# EAGLE schematic proton (EAGLE 8.4.1)
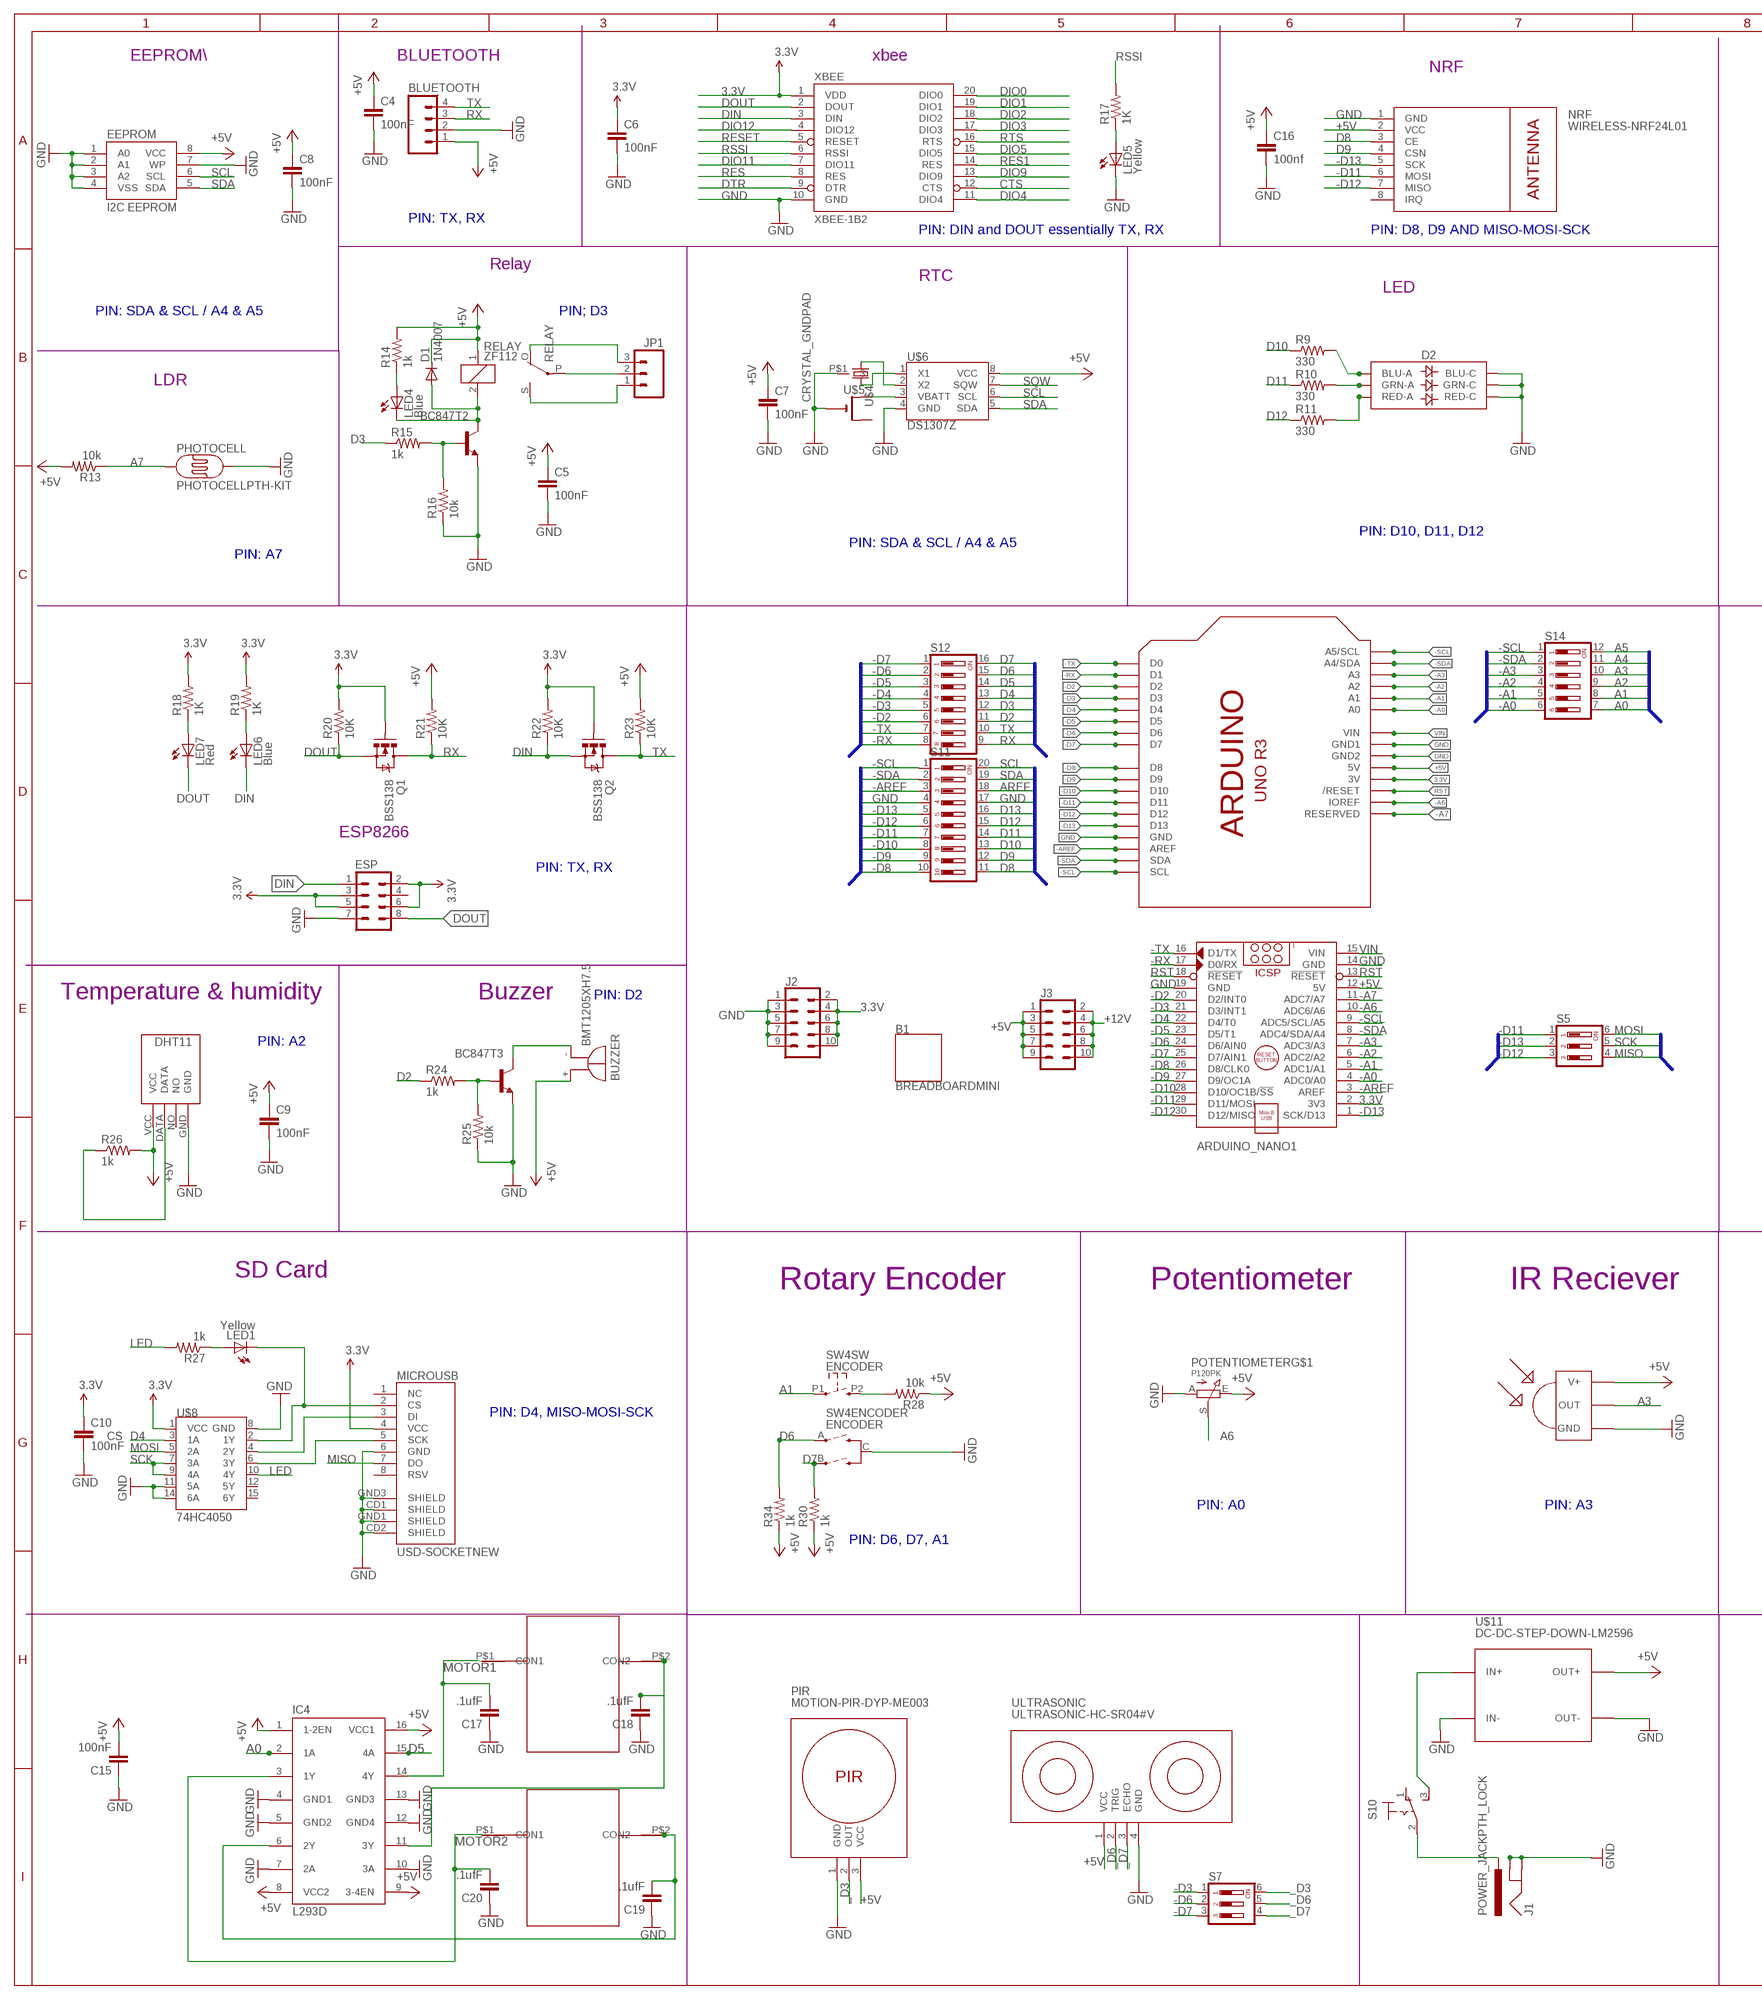
[diagram p0: schematic, sheet 1, part 1 of 2]
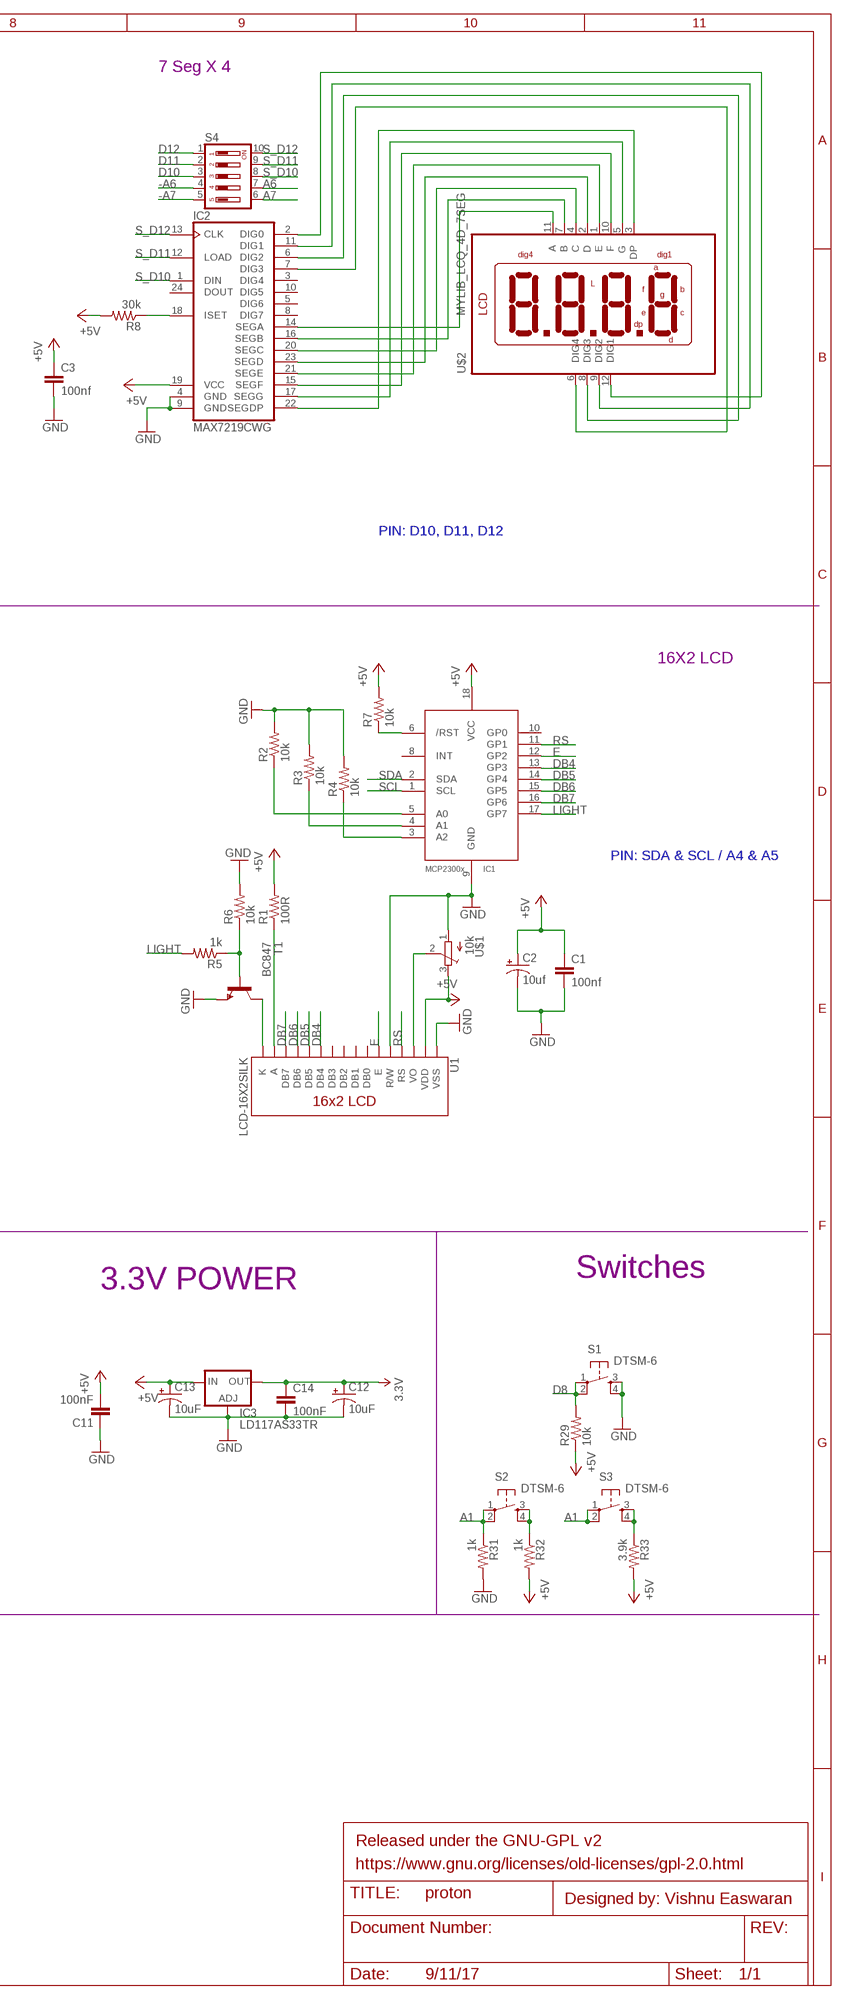
[diagram p1: schematic, sheet 1, part 2 of 2]

## Parts
ARDUINO_NANO1  ARDUINO_NANO  [ARDUINO_NANO]
B1  BREADBOARDMINI  [BREADBOARD-MINI]
BLUETOOTH  M04PTH  [1X04]
BUZZER  BMT1205XH7.5  [BMT1205XH7.5]
C1  100nf  CAP0805  [0805]
C2  10uf  CAP_POL1206  [EIA3216]
C3  100nf  CAP0805  [0805]
C4  100nF  CAP0805  [0805]
C5  100nF  CAP0805  [0805]
C6  100nF  CAP0805  [0805]
C7  100nF  CAP0805  [0805]
C8  100nF  CAP0805  [0805]
C9  100nF  CAP0805  [0805]
C10  100nF  CAP0805  [0805]
C11  100nF  CAP0805  [0805]
C12  10uF  CAP_POL1206  [EIA3216]
C13  10uF  CAP_POL1206  [EIA3216]
C14  100nF  CAP0805  [0805]
C15  100nF  CAP0805  [0805]
C16  100nf  CAP0805  [0805]
C17  .1ufF  CAP0805  [0805]
C18  .1ufF  CAP0805  [0805]
C19  .1ufF  CAP0805  [0805]
C20  .1ufF  CAP0805  [0805]
D1  1N4007  DIODESMA-ALT  [SMA-DIODE_ALT]
D2  LED-RGBNO_IC  [LED-TRICOLOR-5050]
EEPROM  I2C EEPROM  EEPROM-I2CEIAJ  [SO08-EIAJ]
ESP  M04X2  [2X4]
IC1  MCP2300X/SO  [SO18W]
IC2  MAX7219CWG  [SO24W]
IC3  LD117AS33TR  [SOT223]
IC4  L293D  [DIL16]
IR  TSOP1730  [TSOP17XX]
J1  POWER_JACKPTH_LOCK  [POWER_JACK_PTH_LOCK]
J2  CONN_05X2NO_SILK  [2X5_NOSILK]
J3  CONN_05X2NO_SILK  [2X5_NOSILK]
JP1  M03-SCREW-5MM  [SCREWTERMINAL-5MM-3]
LED1  Yellow  LEDCHIPLED_0805  [CHIPLED_0805]
LED4  Blue  LEDCHIPLED_0805  [CHIPLED_0805]
LED5  Yellow  LEDCHIPLED_0805  [CHIPLED_0805]
LED6  Blue  LEDCHIPLED_0805  [CHIPLED_0805]
LED7  Red  LEDCHIPLED_0805  [CHIPLED_0805]
MICROUSB  USD-SOCKETNEW  [MICRO-SD-SOCKET-PP]
MOTOR1  TOY_MOTOR  [TOY_MOTOR]
MOTOR2  TOY_MOTOR  [TOY_MOTOR]
NRF  WIRELESS-NRF24L01  [WIRELESS-NRF24L01]
PHOTOCELL  PHOTOCELLPTH-KIT  [PHOTOCELL-KIT]
PIR  MOTION-PIR-DYP-ME003  [MOTION-PIR-DYP-ME003]
POTENTIOMETER  P120PK  [P120PK]
Q1  BSS138  MOSFET-NCHANNELSMD  [SOT23-3]
Q2  BSS138  MOSFET-NCHANNELSMD  [SOT23-3]
R1  100R  RESISTOR0805-RES  [0805]
R2  10k  RESISTOR0805-RES  [0805]
R3  10k  RESISTOR0805-RES  [0805]
R4  10k  RESISTOR0805-RES  [0805]
R5  1k  RESISTOR0805-RES  [0805]
R6  10k  RESISTOR0805-RES  [0805]
R7  10k  RESISTOR0805-RES  [0805]
R8  30k  RESISTOR0805-RES  [0805]
R9  330  RESISTOR0805-RES  [0805]
R10  330  RESISTOR0805-RES  [0805]
R11  330  RESISTOR0805-RES  [0805]
R13  10k  RESISTOR0805-RES  [0805]
R14  1k  RESISTOR0805-RES  [0805]
R15  1k  RESISTOR0805-RES  [0805]
R16  10k  RESISTOR0805-RES  [0805]
R17  1K  RESISTOR0805-RES  [0805]
R18  1K  RESISTOR0805-RES  [0805]
R19  1K  RESISTOR0805-RES  [0805]
R20  10K  RESISTOR0805-RES  [0805]
R21  10K  RESISTOR0805-RES  [0805]
R22  10K  RESISTOR0805-RES  [0805]
R23  10K  RESISTOR0805-RES  [0805]
R24  1k  RESISTOR0805-RES  [0805]
R25  10k  RESISTOR0805-RES  [0805]
R26  1k  RESISTOR0805-RES  [0805]
R27  1k  RESISTOR0805-RES  [0805]
R28  10k  RESISTOR0805-RES  [0805]
R29  10k  RESISTOR0805-RES  [0805]
R30  1k  RESISTOR0805-RES  [0805]
R31  1k  RESISTOR0805-RES  [0805]
R32  1k  RESISTOR0805-RES  [0805]
R33  3.9k  RESISTOR0805-RES  [0805]
R34  1k  RESISTOR0805-RES  [0805]
RELAY  ZF112  [ZF112]
S1  DTSM-6  [DTSM-6]
S2  DTSM-6  [DTSM-6]
S3  DTSM-6  [DTSM-6]
S4  DIP05YL  [DIP05YL]
S5  DIP03YL  [DIP03YL]
S7  DIP03YL  [DIP03YL]
S10  M9040P  [M9040P]
S11  DIP10YL  [DIP10YL]
S12  DIP08YL  [DIP08YL]
S14  DIP06YL  [DIP06YL]
SW4  ENCODER  ENCODER_SW1-PEC12  [PEC12_INCREMENTAL_ENCODER]
T1  BC847  MMBT2222ALT1-NPN-SOT23-BEC  [SOT23-BEC]
T2  BC847  MMBT2222ALT1-NPN-SOT23-BEC  [SOT23-BEC]
T3  BC847  MMBT2222ALT1-NPN-SOT23-BEC  [SOT23-BEC]
TEMPERATURESENSOR  DHT11  [DHT11]
U1  LCD-16X2SILK  [LCD-16X2]
U$1  10k  TRIMPOTTC33X  [TC33X]
U$2  MYLIB_LCQ_4D_7SEG  [MYLIB_LDQ_4D_7SEG]
U$4  CRYSTAL_GNDPAD  [TC38H_GNDPAD]
U$5  CR1220SMT  [CR1220-SMD]
U$6  DS1307Z  [SO08-0.15]
U$8  74HC4050  HEX_CONVERTER  [SO016]
U$11  DC-DC-STEP-DOWN-LM2596  [DC-DC-STEP-DOWN-LM2596]
U$14  UNO_R3  [UNO_R3]
ULTRASONIC  ULTRASONIC-HC-SR04#V  [ULTRASONIC-HC-SR04#V]
XBEE  XBEE-1B2  [XBEE-SILK]

## Nets
3.3V: ARDUINO_NANO1.2(3V3) C6.1 C10.1 C12.A(+) C14.1 ESP.2 ESP.3 ESP.5 ESP.6 IC3.4(OUT) J2.2 J2.4 J2.6 J2.8 J2.10 MICROUSB.4(VCC) Q1.1(G) Q2.1(G) R18.2 R19.2 R20.2 R22.2 U$8.1(VCC) U$14.3V XBEE.1(VDD)
+5V: ARDUINO_NANO1.12(5V) BLUETOOTH.1 BUZZER.+ C1.1 C2.A(+) C3.1 C4.1 C5.1 C7.1 C8.1 C9.1 C11.2 C13.A(+) C15.2 C16.1 D1.C EEPROM.8(VCC) IC1.18(VCC) IC2.19(VCC) IC3.3(IN) IC4.1(1-2EN) IC4.8(VCC2) IC4.9(3-4EN) IC4.16(VCC1) IR.V+ J3.1 J3.3 J3.5 J3.7 J3.9 NRF.2(VCC) PIR.3(VCC) POTENTIOMETER.E R1.2 R7.2 R8.2 R13.2 R14.2 R21.2 R23.2 R26.2 R28.1 R29.1 R30.1 R32.2 R33.2 R34.1 RELAY.1 TEMPERATURESENSOR.VCC U1.2(VDD) U$1.3(E) U$6.8(VCC) U$11.OUT+ U$14.5V ULTRASONIC.1(VCC)
+12V: J1.PWR J3.2 J3.4 J3.6 J3.8 J3.10 S10.2(P)
-A0: ARDUINO_NANO1.4(ADC0/A0) S14.6 U$14.A0
-A1: ARDUINO_NANO1.5(ADC1/A1) S14.5 U$14.A1
-A2: ARDUINO_NANO1.6(ADC2/A2) S14.4 U$14.A2
-A3: ARDUINO_NANO1.7(ADC3/A3) S14.3 U$14.A3
-A6: ARDUINO_NANO1.10(ADC6/A6) S4.4 U$14.IOREF
-A7: ARDUINO_NANO1.11(ADC7/A7) S4.5 U$14.RESERVED
-AREF: ARDUINO_NANO1.3(AREF) S11.3 U$14.AREF
-D2: ARDUINO_NANO1.20(D2/INT0) S12.6 U$14.D2
-D3: ARDUINO_NANO1.21(D3/INT1) S7.1 S12.5 U$14.D3
-D4: ARDUINO_NANO1.22(D4/T0) S12.4 U$14.D4
-D5: ARDUINO_NANO1.23(D5/T1) S12.3 U$14.D5
-D6: ARDUINO_NANO1.24(D6/AIN0) S7.2 S12.2 U$14.D6
-D7: ARDUINO_NANO1.25(D7/AIN1) S7.3 S12.1 U$14.D7
-D8: ARDUINO_NANO1.26(D8/CLK0) S11.10 U$14.D8
-D9: ARDUINO_NANO1.27(D9/OC1A) S11.9 U$14.D9
-D10: ARDUINO_NANO1.28(D10/OC1B/!SS) S11.8 U$14.D10
-D11: ARDUINO_NANO1.29(D11/MOSI) NRF.6(MOSI) S5.1 S11.7 U$14.D11
-D12: ARDUINO_NANO1.30(D12/MISO) NRF.7(MISO) S5.3 S11.6 U$14.D12
-D13: ARDUINO_NANO1.1(SCK/D13) NRF.5(SCK) S5.2 S11.5 U$14.D13
-RX: ARDUINO_NANO1.17(D0/RX) S12.8 U$14.D1
-SCL: ARDUINO_NANO1.9(ADC5/SCL/A5) S11.1 S14.1 U$14.A5(A5/SCL) U$14.SCL
-SDA: ARDUINO_NANO1.8(ADC4/SDA/A4) S11.2 S14.2 U$14.A4(A4/SDA) U$14.SDA
-TX: ARDUINO_NANO1.16(D1/TX) S12.7 U$14.D0
_D3: PIR.2(OUT) S7.6
_D6: S7.5 ULTRASONIC.2(TRIG)
_D7: S7.4 ULTRASONIC.3(ECHO)
A0: IC4.2(1A) S14.7
A1: R31.1 S2.1 S2.2 S3.1 S3.2 S14.8 SW4.P1
A2: R26.1 S14.9 TEMPERATURESENSOR.DATA
A3: IR.OUT S14.10
A4: S14.11
A5: S14.12
A6: POTENTIOMETER.S S4.7
A7: PHOTOCELL.1 R13.1 S4.6
AREF: S11.18
CTS: XBEE.12(CTS)
D2: R24.1 S12.11
D3: R15.1 S12.12
D4: S12.13 U$8.3(1A)
D5: IC4.15(4A) S12.14
D6: R34.2 S12.15 SW4.A(ENCODER:A)
D7: R30.2 S12.16 SW4.B(ENCODER:B)
D8: NRF.3(CE) R29.2 S1.1 S1.2 S11.11
D9: NRF.4(CSN) S11.12
D10: R9.1 S4.3 S11.13
D11: R10.1 S4.2 S11.14
D12: R11.1 S4.1 S11.15
D13: S11.16
DB4: IC1.13(GP3) U1.11(DB4)
DB5: IC1.14(GP4) U1.12(DB5)
DB6: IC1.15(GP5) U1.13(DB6)
DB7: IC1.16(GP6) U1.14(DB7)
DIN: ESP.1 LED6.C Q2.2(S) R22.1 XBEE.3(DIN)
DIO0: XBEE.20(DIO0)
DIO1: XBEE.19(DIO1)
DIO2: XBEE.18(DIO2)
DIO3: XBEE.17(DIO3)
DIO4: XBEE.11(DIO4)
DIO5: XBEE.15(DIO5)
DIO9: XBEE.13(DIO9)
DIO11: XBEE.7(DIO11)
DIO12: XBEE.4(DIO12)
DOUT: ESP.8 LED7.C Q1.2(S) R20.1 XBEE.2(DOUT)
DTR: XBEE.9(DTR)
E: IC1.12(GP2) U1.6(E)
GND: ARDUINO_NANO1.14(GND) ARDUINO_NANO1.19(GND) BLUETOOTH.2 C1.2 C2.C(-) C3.2 C4.2 C5.2 C6.2 C7.2 C8.2 C9.2 C10.2 C11.1 C12.C(-) C13.C(-) C14.2 C15.1 C16.2 C17.1 C18.1 C19.1 C20.1 D2.4(BLU-C) D2.5(RED-C) D2.6(GRN-C) EEPROM.1(A0) EEPROM.2(A1) EEPROM.3(A2) EEPROM.4(VSS) EEPROM.7(WP) ESP.7 IC1.9(GND) IC2.4(GND) IC2.9(GND) IC3.1(ADJ) IC4.4(GND1) IC4.5(GND2) IC4.7(2A) IC4.10(3A) IC4.12(GND4) IC4.13(GND3) IR.GND J1.GND J1.GNDBREAK J2.1 J2.3 J2.5 J2.7 J2.9 LED5.C MICROUSB.6(GND) MICROUSB.CD1(SHIELD) MICROUSB.CD2(SHIELD) MICROUSB.GND1(SHIELD) MICROUSB.GND3(SHIELD) NRF.1(GND) PHOTOCELL.2 PIR.1(GND) POTENTIOMETER.A R2.2 R3.2 R4.2 R6.2 R16.1 R25.1 R31.2 S1.3 S1.4 S11.4 S11.17 SW4.C(ENCODER:C) T1.E T2.E T3.E TEMPERATURESENSOR.GND U1.1(VSS) U1.5(R/W) U$1.1(A) U$4.P$1 U$5.- U$6.4(GND) U$8.8(GND) U$8.11(5A) U$8.14(6A) U$11.IN- U$11.OUT- U$14.GND U$14.GND1 U$14.GND2 ULTRASONIC.4(GND) XBEE.10(GND)
LED: R27.2 U$8.10(4Y)
LIGHT: IC1.17(GP7) R5.2
MISO: MICROUSB.7(DO) S5.4
MOSI: S5.6 U$8.5(2A)
MOTOR1: C17.2 IC4.14(4Y) MOTOR1.P$1(CON1)
MOTOR2: C20.2 IC4.3(1Y) MOTOR2.P$1(CON1)
N$1: C19.2 IC4.6(2Y) MOTOR2.P$2(CON2)
N$3: S10.3(S) U$11.IN+
N$4: D2.3(BLU-A) R9.2
N$5: R32.1 S2.3 S2.4
N$6: D2.2(RED-A) R11.2
N$7: D2.1(GRN-A) R10.2
N$8: R24.2 R25.2 T3.B
N$9: C18.2 IC4.11(3Y) MOTOR1.P$2(CON2)
N$11: R33.1 S3.3 S3.4
N$14: JP1.3 RELAY.O(2:O)
N$18: BUZZER.- T3.C
N$19: LED4.A R14.1
N$20: R15.2 R16.2 T2.B
N$21: D1.A LED4.C RELAY.2 T2.C
N$24: JP1.2 RELAY.P(2:P)
N$25: JP1.1 RELAY.S(2:S)
N$29: IC1.5(A0) R2.1
N$30: IC1.4(A1) R3.1
N$31: IC1.3(A2) R4.1
N$32: R28.2 SW4.P2
N$33: R5.1 R6.1 T1.B
N$34: U1.3(VO) U$1.2(S)
N$35: T1.C U1.16(K)
N$36: U$4.1 U$6.2(X2)
N$37: U$5.+$1(+) U$6.3(VBATT)
N$38: IC2.14(SEGA) U$2.11(A)
N$39: MICROUSB.3(DI) U$8.4(2Y)
N$40: MICROUSB.5(SCK) U$8.6(3Y)
N$41: U$4.2 U$6.1(X1)
N$42: LED1.A R27.1
N$43: LED1.C MICROUSB.2(CS) U$8.2(1Y)
N$46: LED5.A R17.1
N$49: LED7.A R18.1
N$50: LED6.A R19.1
N$52: IC1.6(/RST) R7.1
N$53: IC2.18(ISET) R8.1
N$54: IC2.16(SEGB) U$2.7(B)
N$55: IC2.20(SEGC) U$2.4(C)
N$56: IC2.23(SEGD) U$2.2(D)
N$57: IC2.21(SEGE) U$2.1(E)
N$58: IC2.15(SEGF) U$2.10(F)
N$59: IC2.17(SEGG) U$2.5(G)
N$60: IC2.22(SEGDP) U$2.3(DP)
N$61: IC2.7(DIG3) U$2.6(DIG4)
N$62: IC2.6(DIG2) U$2.8(DIG3)
N$63: IC2.11(DIG1) U$2.9(DIG2)
N$64: IC2.2(DIG0) U$2.12(DIG1)
N$65: R1.1 U1.15(A)
RES: XBEE.8(RES)
RES1: XBEE.14(RES)
RESET: XBEE.5(RESET)
RS: IC1.11(GP1) U1.4(RS)
RSSI: R17.2 XBEE.6(RSSI)
RST: ARDUINO_NANO1.13(!RESET) ARDUINO_NANO1.18(!RESET) U$14.RESET(/RESET)
RTS: XBEE.16(RTS)
RX: BLUETOOTH.3 Q1.3(D) R21.1 S12.9
S_D10: IC2.1(DIN) S4.8
S_D11: IC2.12(LOAD) S4.9
S_D12: IC2.13(CLK) S4.10
SCK: S5.5 U$8.7(3A) U$8.9(4A)
SCL: EEPROM.6(SCL) IC1.1(SCL) S11.20 U$6.6(SCL)
SDA: EEPROM.5(SDA) IC1.2(SDA) S11.19 U$6.5(SDA)
SQW: U$6.7(SQW)
TX: BLUETOOTH.4 Q2.3(D) R23.1 S12.10
VIN: ARDUINO_NANO1.15(VIN) U$14.VIN
Unconnected: ESP.4 IC1.8(INT) IC1.10(GP0) IC2.3(DIG4) IC2.5(DIG6) IC2.8(DIG7) IC2.10(DIG5) IC2.24(DOUT) MICROUSB.1(NC) MICROUSB.8(RSV) NRF.8(IRQ) POTENTIOMETER.M1(GND) POTENTIOMETER.M2(GND) S10.1(O) TEMPERATURESENSOR.NO U1.7(DB0) U1.8(DB1) U1.9(DB2) U1.10(DB3) U$5.+$2(+1) U$8.12(5Y) U$8.15(6Y)

## Buses
SCL,SDA,AREF,GND,D13,D12,D11,D10,D9,D8
D7,D6,D5,D4,SCL,SDA,TX,RX
A0,A1,A2,A3,A4,A5
A_SCL,A_SDA,A_AREF,GND,13,12,11,10,9,8
7,6,5,4,A_SCL,A_SDA,A_TX,A_RX
A_A0,A_A1,A_A2,A_A3,A_A4,A_A5
MOSI,SCK,MISO
A_MOSI,A_SCK,A_MISO

## Notes on the sheet
- EEPROM\ | BLUETOOTH | xbee
- NRF | 7 Seg X 4
- PIN: TX, RX
- PIN: DIN and DOUT essentially TX, RX | PIN: D8, D9 AND MISO-MOSI-SCK
- Relay
- RTC
- LED
- PIN: SDA & SCL / A4 & A5 | PIN; D3
- LDR
- PIN: D10, D11, D12 | PIN: D10, D11, D12
- PIN: SDA & SCL / A4 & A5
- PIN: A7
- 16X2 LCD
- ESP8266
- PIN: SDA & SCL / A4 & A5
- PIN: TX, RX
- Temperature & humidity | Buzzer | PIN: D2
- PIN: A2
- SD Card | Switches
- Rotary Encoder | Potentiometer | IR Reciever | 3.3V POWER
- PIN: D4, MISO-MOSI-SCK
- CS
- PIN: A0 | PIN: A3
- PIN: D6, D7, A1
- Released under the GNU-GPL v2
- https://www.gnu.org/licenses/old-licenses/gpl-2.0.html
- Designed by: Vishnu Easwaran
- 9/11/17

## Library data of the parts
ARDUINO_NANO1 = ArduinoNanoV30:ARDUINO_NANO: Arduino Nano V3.0 Module Overview: The Arduino Nano is a small, complete, and breadboard-friendly board based on the ATmega328 (Arduino Nano 3.x) or ATmega168 (Arduino Nano 2.x). It has more or less the same functionality of the Arduino Duemilanove, but in a different package. It lacks only a DC power jack, and works with a Mini-B USB cable instead of a standard one. The Nano was designed and is being produced by Gravitech <http://www.gravitech.us/arna30wiatp.html>. General specifications: Item Value Microcontroller Atmel ATmega168 or ATmega328 Operating Voltage (logic level) 5 V Input Voltage (recommended) 7-12 V Input Voltage (limits) 6-20 V Digital I/O Pins 14 (of which 6 provide PWM output) Analog Input Pins 8 DC Current per I/O Pin 40 mA Flash Memory 16 KB (ATmega168) or 32 KB (ATmega328) of which 2 KB used by bootloader SRAM 1 KB (ATmega168) or 2 KB (ATmega328) EEPROM 512 bytes (ATmega168) or 1 KB (ATmega328) Clock Speed 16 MHz Dimensions (Inches) 0.73" x 1.70" Dimensions (mm) 18mm x 45mm Overall height About 9 mm (not including pins) Weigth 5 g Power: The Arduino Nano can be powered via the Mini-B USB connection, 6-20V unregulated external power supply (pin 30), or 5V regulated external power supply (pin 27). The power source is automatically selected to the highest voltage source. Memory: The ATmega168 has 16 KB of flash memory for storing code (of which 2 KB is used for the bootloader); the ATmega328 has 32 KB, (also with 2 KB used for the bootloader). The ATmega168 has 1 KB of SRAM and 512 bytes of EEPROM (which can be read and written with the EEPROM library); the ATmega328 has 2 KB of SRAM and 1 KB of EEPROM. Input and Output: Each of the 14 digital pins on the Nano can be used as an input or output, using pinMode(), digitalWrite(), and digitalRead() functions. They operate at 5 volts. Each pin can provide or receive a maximum of 40 mA and has an internal pull-up resistor (disconnected by default) of 20-50 kOhms. In addition, some pins have specialized functions. Visit Arduino - ArduinoBoardNano <https://www.arduino.cc/en/Main/ArduinoBoardNano>
B1 = SparkFun-Boards:BREADBOARD: SparkFun Breadboard Mini This is the mechnical outline for the very small self adhesive breadboard from SparkFun Electronics and our prototyping breadboard of the same size. Good for very small proto areas. SparkFun Products: White <https://www.sparkfun.com/products/7916> Green <https://www.sparkfun.com/products/12046> Black <https://www.sparkfun.com/products/12047> Red <https://www.sparkfun.com/products/12044> Blue <https://www.sparkfun.com/products/12045> SparkFun Solder-able Breadboard-Mini <https://www.sparkfun.com/products/12702>; PROD_ID: COMP-12034
BLUETOOTH = SparkFun:M04: Header 4 Standard 4-pin 0.1" header. Use with straight break away headers (SKU : PRT-00116), right angle break away headers (PRT-00553), swiss pins (PRT-00743), machine pins (PRT-00117), and female headers (PRT-00115). Molex polarized connector foot print use with SKU : PRT-08231 with associated crimp pins and housings. 1MM SMD Version SKU: PRT-10208
BUZZER = buzzer:BMT1205XH7.5: MAGNETIC TRANSDUCER Source: Http:www.be-star.com; OC_FARNELL: unknown; OC_NEWARK: unknown
C1 C3-C11 C14-C20 = SparkFun:CAP: Capacitor Standard 0603 ceramic capacitor, and 0.1" leaded capacitor.
C2 C12 C13 = SparkFun:CAP_POL: Capacitor Polarized These are standard SMD and PTH capacitors. Normally 10uF, 47uF, and 100uF in electrolytic and tantalum varieties. Always verify the external diameter of the through hole cap, it varies with capacity, voltage, and manufacturer. The EIA devices should be standard.
D1 = SparkFun:DIODE: Diode These are standard reverse protection diodes and small signal diodes. SMA package can handle up to about 1A. SOD-323 can handle about 200mA. What the SOD-323 package when ordering, there are some mfgs out there that are 5-pin packages.
D2 = SparkFun-LED:LED-RGB: LED-RGB 6 pin RGB LED (no common connector) Packages: PLCC-6 LED-TRICOLOR-5050 - No built-in IC SparkFun Products: Digital Sandbox <https://www.sparkfun.com/products/12651> LED- SMD RGB <https://www.sparkfun.com/products/10866>; PROD_ID: DIO-10298
EEPROM = SparkFun-IC-Memory:EEPROM-I2C: I2C EEPROMs, 24LC256 and others 24LC256 Series 256 kb I2C 2 Wire (32 k x 8 Bit) 2.5 V Serial EEPROM SMD - SOIC-8 Datasheet SparkFun Products SparkFun UDB5 - PIC UAV Development Board <https://www.sparkfun.com/products/11703> (GPS-11703); PROD_ID: NA-XXXXX
ESP = SparkFun-Connectors:M04X2: .1" header, two rows of four.
IC1 = adafruit:MCP2300X: MCP23008 Inexpensive i2c i/o expander - 8 general purpose i/o pins with optional pullups
IC2 = maxim-10:MAX7219*: Serially Interfaced, 8-Digit LED Display Drivers
IC3 = v-reg:LD117A?*: Low drop fixed and adjustable positive voltage regulators 1 A Source: http://www.st.com/stonline/products/literature/ds/7194/ld1117axx.pdf
IC4 = st-microelectronics:L293D: PUSH-PULL 4 CHANNEL DRIVER; MPN: L293D; OC_FARNELL: 9589619; OC_NEWARK: 56P8249
IR = tsop:TSOP1730: IR Receiver and Demodulator
J1 = SparkFun-Connectors:POWER_JACK: Power Jack Connector This is the standard 5.5mm barrel jack for power. The PTH is the most common, proven, reliable, footprint. The Slot footprint only works if the mill layer is transmitted to the PCB fab house so be warned. Here are the connectors we sell at SparkFun: DC Barrel Power Jack/Connector <https://www.sparkfun.com/products/119> (PRT-00119) DC Barrel Power Jack/Connector (SMD) <https://www.sparkfun.com/products/12748> (PRT-12748) DC Barrel Jack Adapter - Breadboard Compatible <https://www.sparkfun.com/products/10811> (PRT-10811) It is used on this SparkFun product (and many, many others): SparkFun RedBoard - Programmed with Arduino <https://www.sparkfun.com/products/12757> (DEV-12757) Also, if you need a mating power supply or connector, please check these out: Wall Adapter Power Supply - 9VDC 650mA <https://www.sparkfun.com/products/298> (TOL-00298) DC Barrel Jack Adapter - Male <https://www.sparkfun.com/products/10287> (PRT-10287); PROD_ID: CONN-08197; SF_ID: PRT-00119
J2 J3 = SparkFun-Connectors:CONN_05X2: Multi connection point. Often used as Generic Header-pin footprint for 0.1 inch spaced/style header connections For AVR SPI programming port, see special device with nice symbol: "AVR_SPI_PROG_5x2.dev" You can populate with any combo of single row headers, but if you'd like an exact match, check these: 2x5 AVR ICSP Male Header <https://www.sparkfun.com/products/778> (PRT-00778) 2x5 Pin Shrouded Header <https://www.sparkfun.com/products/8506> (PRT-08506) On any of the 0.1 inch spaced packages, you can populate with these: Break Away Headers - Straight <https://www.sparkfun.com/products/116> (PRT-00116) Break Away Male Headers - Right Angle <https://www.sparkfun.com/products/553> (PRT-00553) Female Headers <https://www.sparkfun.com/products/115> (PRT-00115) Break Away Headers - Machine Pin <https://www.sparkfun.com/products/117> (PRT-00117) Break Away Female Headers - Swiss Machine Pin <https://www.sparkfun.com/products/743> (PRT-00743) Special note: the shrouded connector mates well with our 5x2 ribbon cables: 2x5 Pin IDC Ribbon Cable <https://www.sparkfun.com/products/8535> (PRT-08535)
JP1 = SparkFun:M03: Header 3 Standard 3-pin 0.1" header. Use with straight break away headers (SKU : PRT-00116), right angle break away headers (PRT-00553), swiss pins (PRT-00743), machine pins (PRT-00117), and female headers (PRT-00115). Molex polarized connector foot print use with SKU : PRT-08232 with associated crimp pins and housings.
LED1 LED4-LED7 = led:LED: LED OSRAM: - CHIPLED LG R971, LG N971, LY N971, LG Q971, LY Q971, LO R971, LY R971 LH N974, LH R974 LS Q976, LO Q976, LY Q976 LO Q996 - Hyper CHIPLED LW Q18S LB Q993, LB Q99A, LB R99A - SideLED LS A670, LO A670, LY A670, LG A670, LP A670 LB A673, LV A673, LT A673, LW A673 LH A674 LY A675 LS A676, LA A676, LO A676, LY A676, LW A676 LS A679, LY A679, LG A679 - Hyper Micro SIDELED® LS Y876, LA Y876, LO Y876, LY Y876 LT Y87S - SmartLED LW L88C, LW L88S LB L89C, LB L89S, LG L890 LS L89K, LO L89K, LY L89K LS L896, LA L896, LO L896, LY L896 - TOPLED LS T670, LO T670, LY T670, LG T670, LP T670 LSG T670, LSP T670, LSY T670, LOP T670, LYG T670 LG T671, LOG T671, LSG T671 LB T673, LV T673, LT T673, LW T673 LH T674 LS T676, LA T676, LO T676, LY T676, LB T676, LH T676, LSB T676, LW T676 LB T67C, LV T67C, LT T67C, LS T67K, LO T67K, LY T67K, LW E67C LS E67B, LA E67B, LO E67B, LY E67B, LB E67C, LV E67C, LT E67C LW T67C LS T679, LY T679, LG T679 LS T770, LO T770, LY T770, LG T770, LP T770 LB T773, LV T773, LT T773, LW T773 LH T774 LS E675, LA E675, LY E675, LS T675 LS T776, LA T776, LO T776, LY T776, LB T776 LHGB T686 LT T68C, LB T68C - Hyper Mini TOPLED® LB M676 - Mini TOPLED Santana® LG M470 LS M47K, LO M47K, LY M47K Source: http://www.osram.convergy.de LUXEON: - LUMILED® LXK2-PW12-R00, LXK2-PW12-S00, LXK2-PW14-U00, LXK2-PW14-V00 LXK2-PM12-R00, LXK2-PM12-S00, LXK2-PM14-U00 LXK2-PE12-Q00, LXK2-PE12-R00, LXK2-PE12-S00, LXK2-PE14-T00, LXK2-PE14-U00 LXK2-PB12-K00, LXK2-PB12-L00, LXK2-PB12-M00, LXK2-PB14-N00, LXK2-PB14-P00, LXK2-PB14-Q00 LXK2-PR12-L00, LXK2-PR12-M00, LXK2-PR14-Q00, LXK2-PR14-R00 LXK2-PD12-Q00, LXK2-PD12-R00, LXK2-PD12-S00 LXK2-PH12-R00, LXK2-PH12-S00 LXK2-PL12-P00, LXK2-PL12-Q00, LXK2-PL12-R00 Source: www.luxeon.com KINGBRIGHT: KA-3528ASYC Source: www.kingbright.com
MICROUSB = SparkFun:USD-SOCKET: microSD Socket Push-push type uSD socket. Schematic element and footprint production proven. Spark Fun Electronics SKU : PRT-00127. tDoc lines correctly indicate media card edge positions when inserting (unlocked, locked, depressed).
MOTOR1 MOTOR2 = toyMotor:TOY_MOTOR
NRF = diy-modules:WIRELESS-NRF24L01: 2.4 GHz Wireless Module based on NRF24L01 chip
PHOTOCELL = SparkFun:PHOTOCELL: Photocell Also known as a CdS photoresistor. This is a low cost way to detect light levels. Resistance decreases with more incoming light. SparkFun SKU: SEN-09088
PIR = diy-modules:MOTION-PIR-DYP-ME003: PIR Motion Sensor Module DYP-ME003 based on BISS0001 pyroelectic detector Click here to find device on ebay.com <http://www.ebay.com/sch/dyp+me003>
POTENTIOMETER = pot-tt_electronics:P120PK
Q1 Q2 = SparkFun:MOSFET-NCHANNEL
R1-R11 R13-R34 = SparkFun:RESISTOR: Resistor Basic schematic elements and footprints for 0603, 1206, and PTH resistors.
RELAY = relay:ZF112: RELAY 1 x switch; OC_FARNELL: unknown; OC_NEWARK: unknown
S1-S3 = switch-tact:DTSM-6
S4 = switch-dil:DIP05YL: DIL/CODE SWITCH; OC_FARNELL: unknown; OC_NEWARK: unknown
S5 S7 = switch-dil:DIP03YL: DIL/CODE SWITCH; OC_FARNELL: unknown; OC_NEWARK: unknown
S10 = switch:M9040P: TOGGLE SWITCH Marquardt
S11 = switch-dil:DIP10YL: DIL/CODE SWITCH; OC_FARNELL: unknown; OC_NEWARK: unknown
S12 = switch-dil:DIP08YL: DIL/CODE SWITCH; OC_FARNELL: unknown; OC_NEWARK: unknown
S14 = switch-dil:DIP06YL: DIL/CODE SWITCH; OC_FARNELL: unknown; OC_NEWARK: unknown
SW4 = dp_devices:ENCODER_SW1: Incremental Encoder with push switch
T1-T3 = transistor:*-NPN-: NPN Transistror BF959 corrected 2008.03.06
TEMPERATURESENSOR = DHT11:DHT11: DHT11 Czujnik temperatury i wilgotności
U1 = SparkFun-Displays:LCD-16X2: Standard text-only 16x2 parallel input LCD Basic 16 character by 2 line display. Typically utilizes the extremely common HD44780 parallel interface chipset SparkFun Products: Basic 16x2 Green <https://www.sparkfun.com/products/255> Basic 8x2 Green <https://www.sparkfun.com/products/11122>; SF_ID: LCD-00255
U$1 = adafruit:TRIMPOT: SMT trimmer potentiometer part number TC33X http://www.ladyada.net/library/eagle
U$2 = 4_Digit_DIsplay:MYLIB_LCQ_4D_7SEG
U$4 = crystal:CRYSTAL_GNDPAD
U$5 = adafruit:CR1220: CR1216/CR1220/CR1225 12mm 3V lithium coin cell Great for battery packup. Both SMT and THM holders. Note the THM package has the ground pads on both sides of the PCB so that the masks are the same - this reduces the cost
U$6 = SparkFun-Clocks:DS1307: Maxim DS1307 - I2C Real-time clock (RTC) The DS1307 serial real-time clock (RTC) is a low-power, full binary-coded decimal (BCD) clock/calendar plus 56 bytes of NV SRAM. Address and data are transferred serially through an I2C, bidirectional bus. The clock/calendar provides seconds, minutes, hours, day, date, month, and year information. SparkFun Products: Real Time Clock Module <https://www.sparkfun.com/products/12708> (BOB-12708) Datasheet <https://cdn.sparkfun.com/datasheets/BreakoutBoards/DS1307.pdf>; PROD_ID: IC-08138
U$8 = SparkFun:HEX_CONVERTER
U$11 = diy-modules:DC-DC-STEP-DOWN-LM2596: DC/DC Step-Down Regulator based on LM2596-ADJ chip LM2596 datasheet available here: http://www.ti.com/lit/ds/symlink/lm2596.pdf Click here to find device on ebay.com <http://www.ebay.com/sch/lm2596+power+regulator>; SPICEPREFIX: E
U$14 = UNO_R3:UNO_R3
ULTRASONIC = diy-modules:ULTRASONIC-HC-SR04: Ultrasonic Ranging Module HC-SR04 More details available here: http://randomnerdtutorials.com/complete-guide-for-ultrasonic-sensor-hc-sr04/ Click here to find device on ebay.com <http://www.ebay.com/sch/hc+sr04+ultrasonic>
XBEE = SparkFun:XBEE-1